# EAGLE design BasePCB (EAGLE 9.5.2)
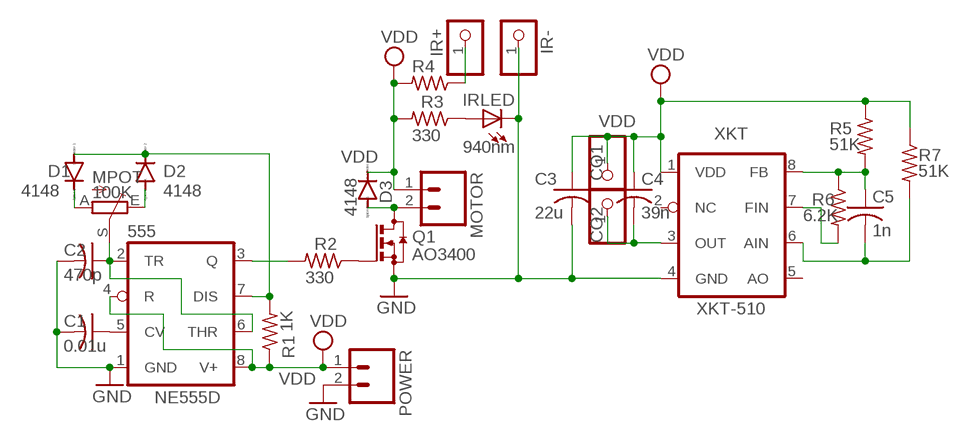
[diagram p0: schematic, sheet 1]

## Parts
555  NE555D  [SO08]
C1  0.01u  C-USC0603K  [C0603K]
C2  470p  C-USC0603K  [C0603K]
C3  22u  C-USC0805K  [C0805K]
C4  39n  C-USC0805K  [C0805K]
C5  1n  C-USC0805K  [C0805K]
CO1  PINHD-1X1CB  [1X01-CLEANBIG]
CO2  PINHD-1X1CB  [1X01-CLEANBIG]
D1  4148  DIODE-MINIMELF  [MINIMELF]
D2  4148  DIODE-MINIMELF  [MINIMELF]
D3  4148  DIODE-MINIMELF  [MINIMELF]
IR+  PINHD-1X1CB  [1X01-CLEANBIG]
IR-  PINHD-1X1CB  [1X01-CLEANBIG]
IRLED  940nm  LEDCHIPLED_0603  [CHIPLED_0603]
MOTOR  M021X02_NO_SILK  [1X02_NO_SILK]
MPOT  100K  TRIM_EU-CA6V  [CA6V]
POWER  M021X02_NO_SILK  [1X02_NO_SILK]
Q1  AO3400  BSS123  [SOT23]
R1  1K  R-US_R0603  [R0603]
R2  330  R-US_R0603  [R0603]
R3  330  R-US_R0603  [R0603]
R4  330  R-US_R0603  [R0603]
R5  51K  R-US_R0603  [R0603]
R6  6.2K  R-US_R0603  [R0603]
R7  51K  R-US_R0603  [R0603]
XKT  XKT-510  [SO08]

## Nets
GND: 555.1(GND) C1.2 C2.2 C3.2 IR-.1 IRLED.C POWER.2 Q1.2(S) XKT.4(GND)
N$1: 555.5(CV) C1.1
N$2: D1.C MPOT.A
N$3: 555.3(Q) R2.2
N$4: 555.2(TR) 555.6(THR) C2.1 MPOT.S
N$5: D2.A MPOT.E
N$6: 555.7(DIS) D1.A D2.C R1.2
N$7: Q1.1(G) R2.1
N$8: D3.A MOTOR.2 Q1.3(D)
N$9: IRLED.A R3.1
N$10: IR+.1 R4.1
N$11: C5.1 R5.2 R6.1 XKT.8(FB)
N$12: C4.2 CO2.1 XKT.3(OUT)
N$13: C5.2 R7.2 XKT.6(AIN)
N$14: R6.2 XKT.7(FIN)
VDD [VDD]: 555.4(R) 555.8(V+) C3.1 C4.1 CO1.1 D3.C MOTOR.1 POWER.1 R1.1 R3.2 R4.2 R5.1 R7.1 XKT.1(VDD)
Unconnected: XKT.2(NC) XKT.5(AO)

## Library data of the parts
555 = adafruit2013:*555: TIMER Changed DIP package to have round (not oval) pin pads http://www.ladyada.net/library/pcb/eaglelibrary.html
C1-C5 = adafruit2013:C-US: CAPACITOR, American symbol
CO1 CO2 IR+ IR- = adafruit2013:PINHD-1X1: Pin header 1x1 for 0.1" spacing With round pins
D1-D3 = diode:DIODE-: DIODE
IRLED = adafruit2013:LED: LED OSRAM: - CHIPLED LG R971, LG N971, LY N971, LG Q971, LY Q971, LO R971, LY R971 LH N974, LH R974 LS Q976, LO Q976, LY Q976 LO Q996 - Hyper CHIPLED LW Q18S LB Q993, LB Q99A, LB R99A - SideLED LS A670, LO A670, LY A670, LG A670, LP A670 LB A673, LV A673, LT A673, LW A673 LH A674 LY A675 LS A676, LA A676, LO A676, LY A676, LW A676 LS A679, LY A679, LG A679 - Hyper Micro SIDELED® LS Y876, LA Y876, LO Y876, LY Y876 LT Y87S - SmartLED LW L88C, LW L88S LB L89C, LB L89S, LG L890 LS L89K, LO L89K, LY L89K LS L896, LA L896, LO L896, LY L896 - TOPLED LS T670, LO T670, LY T670, LG T670, LP T670 LSG T670, LSP T670, LSY T670, LOP T670, LYG T670 LG T671, LOG T671, LSG T671 LB T673, LV T673, LT T673, LW T673 LH T674 LS T676, LA T676, LO T676, LY T676, LB T676, LH T676, LSB T676, LW T676 LB T67C, LV T67C, LT T67C, LS T67K, LO T67K, LY T67K, LW E67C LS E67B, LA E67B, LO E67B, LY E67B, LB E67C, LV E67C, LT E67C LW T67C LS T679, LY T679, LG T679 LS T770, LO T770, LY T770, LG T770, LP T770 LB T773, LV T773, LT T773, LW T773 LH T774 LS E675, LA E675, LY E675, LS T675 LS T776, LA T776, LO T776, LY T776, LB T776 LHGB T686 LT T68C, LB T68C - Hyper Mini TOPLED® LB M676 - Mini TOPLED Santana® LG M470 LS M47K, LO M47K, LY M47K Source: http://www.osram.convergy.de/
MOTOR POWER = SparkFunNew:M02: Header 2 Standard 2-pin 0.1" header. Use with straight break away headers (SKU : PRT-00116), right angle break away headers (PRT-00553), swiss pins (PRT-00743), machine pins (PRT-00117), and female headers (PRT-00115). Molex polarized connector foot print use with SKU : PRT-08233 with associated crimp pins and housings.
MPOT = pot:TRIM_EU-: POTENTIOMETER
Q1 = transistor-small-signal:BSS123: N-CHANNEL MOS FET
R1-R7 = adafruit2013:R-US_: RESISTOR, American symbol
XKT = adafruit2013:XKT-510

## Net classes
0 default: width 0.305 mm, clearance 0.254 mm
1 VDD: width 0.61 mm, clearance 0.305 mm

## Board
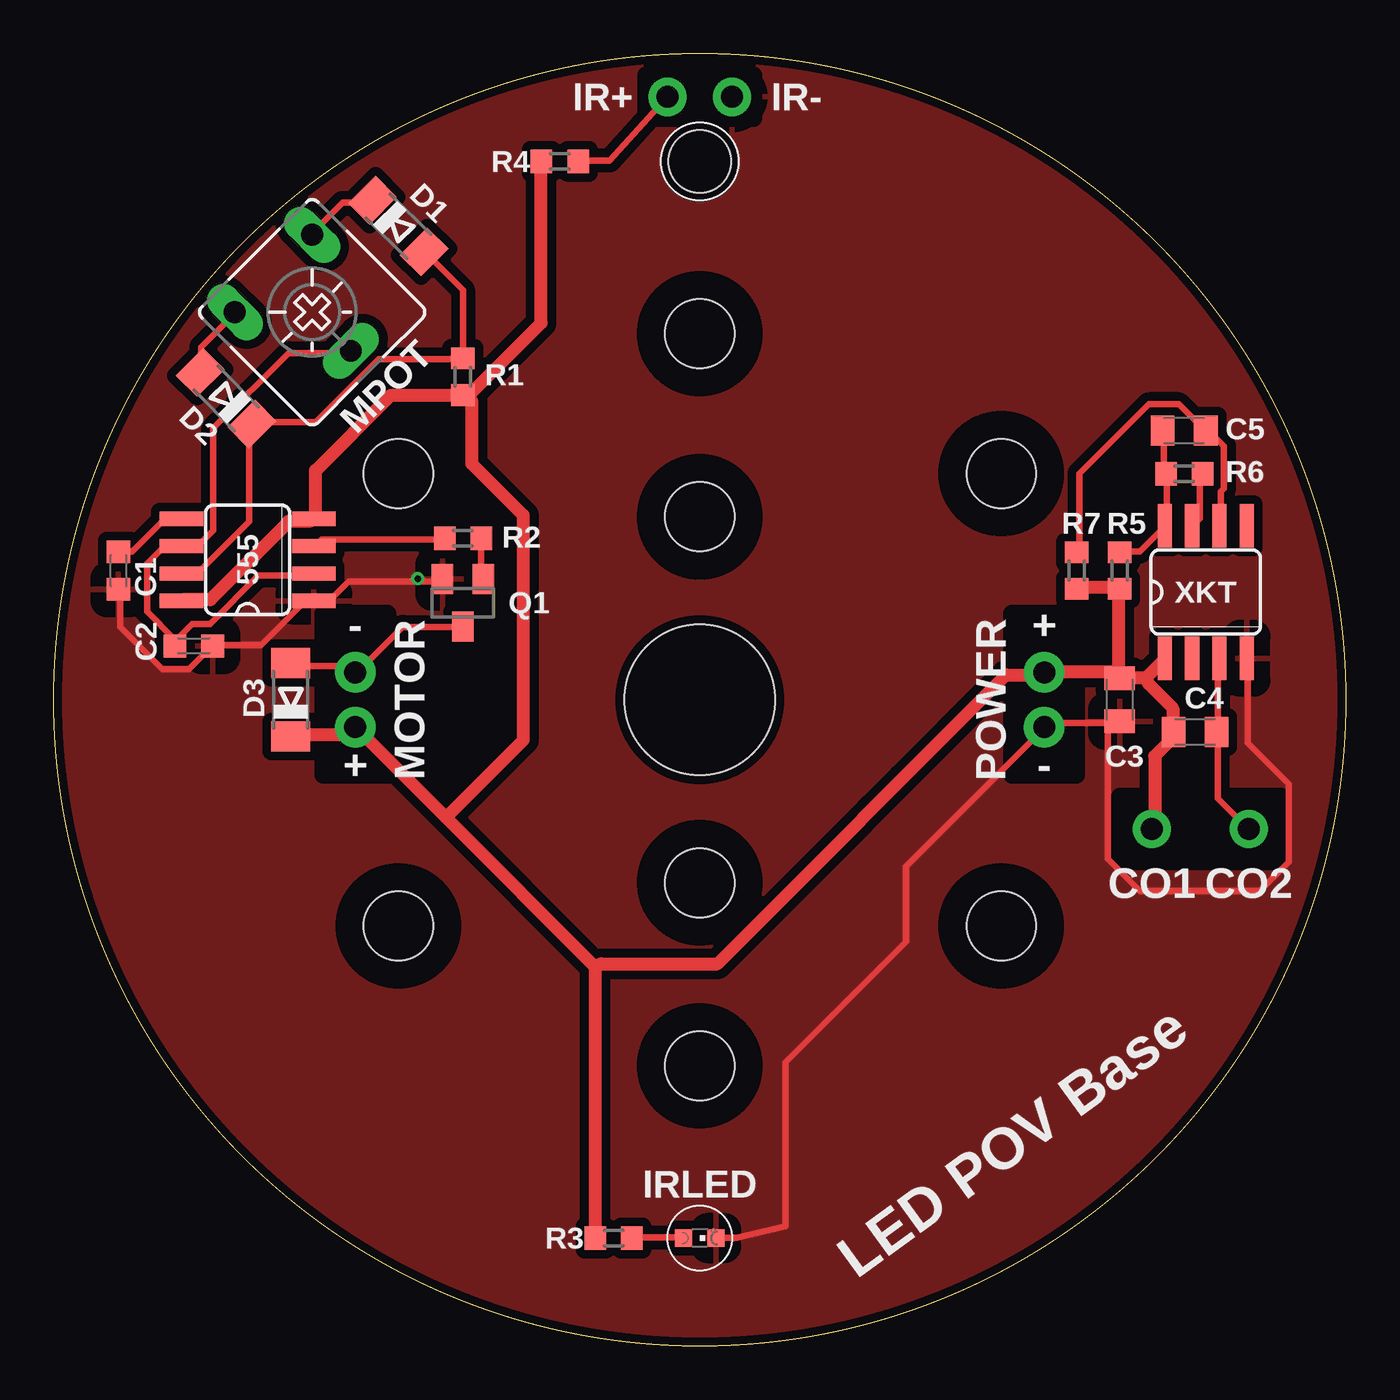
[diagram p1: board, top side]
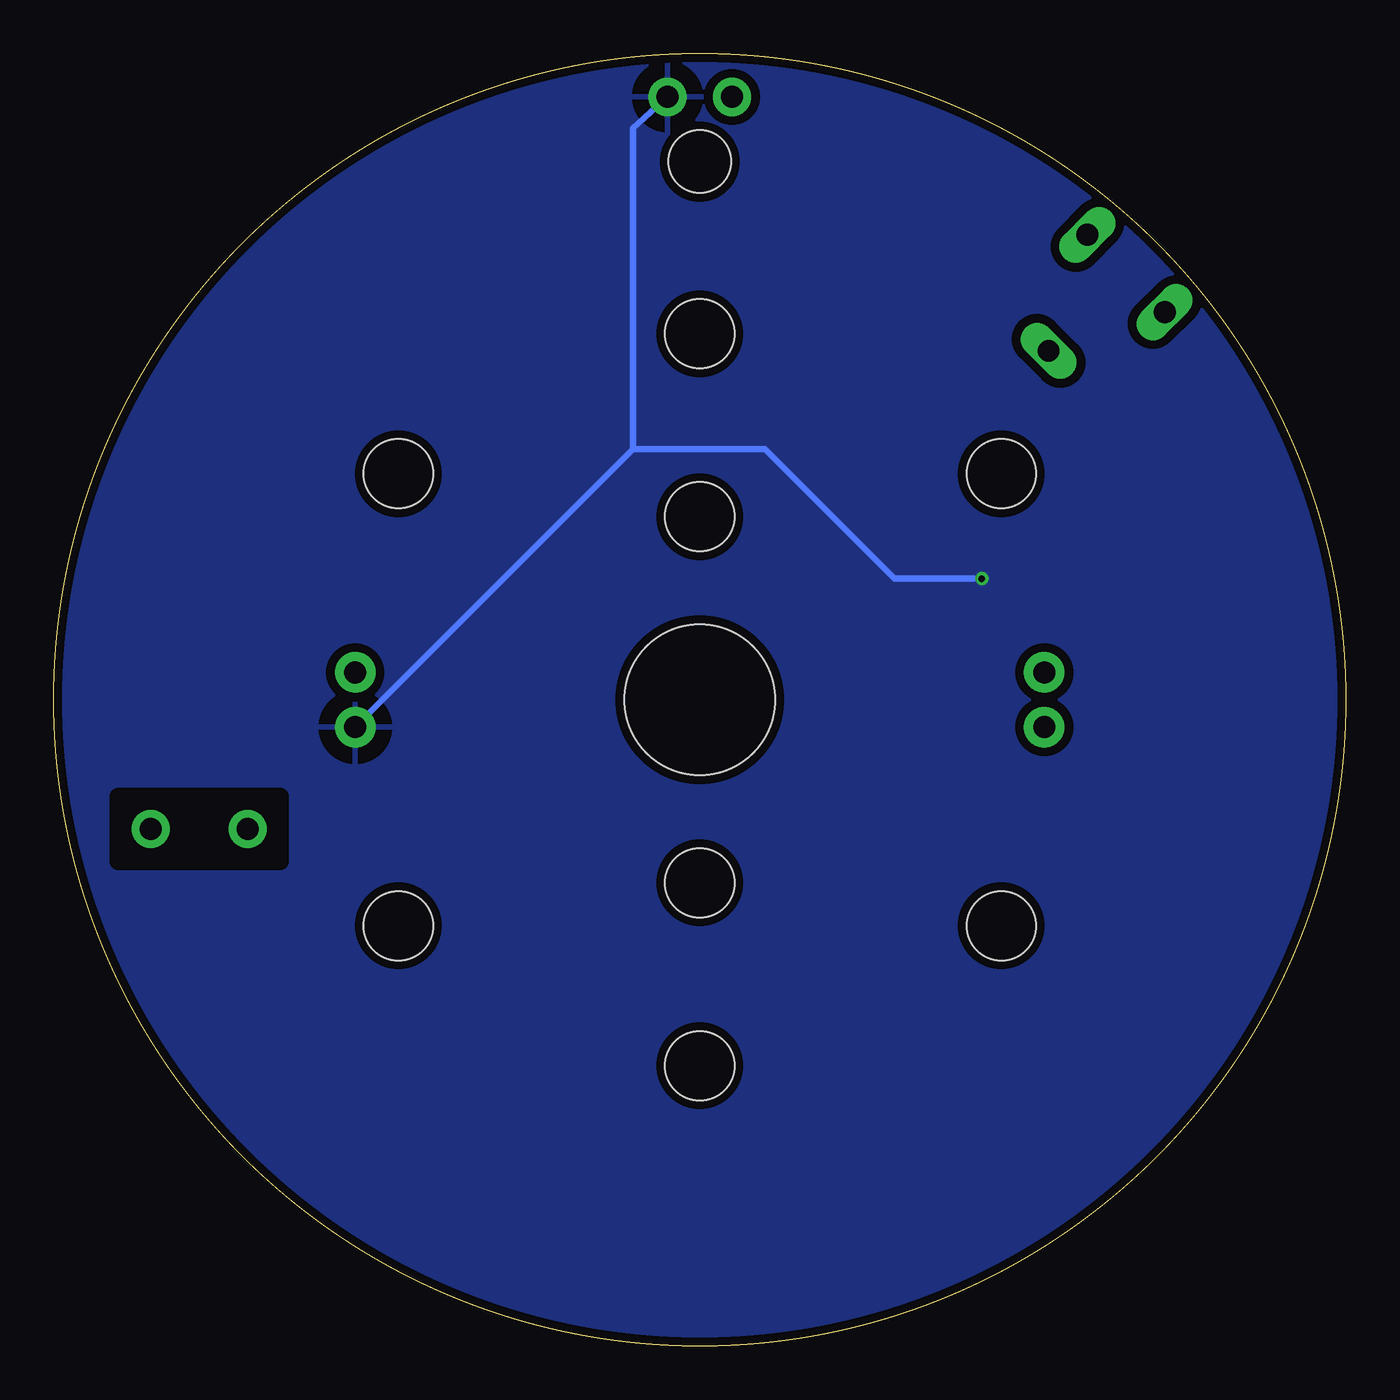
[diagram p2: board, bottom side, seen from below]

Size 60 x 60 mm. Coordinates in mm from the lower left corner, seen from the top.
Outline: circle at 30,30 radius 30
Copper layers (1*16): Top 0.035mm / dielectric 1.5mm / Bottom 0.035mm
Design rules "Fusion_eagle_rule_v1.1 *": minimum track width 6mil, minimum drill 12mil, track to track 6mil, track to pad 6mil, pad to pad 6mil, via to via 6mil, smd to smd 0mil, copper to edge 10mil, drill to drill 10mil, minimum pad ring 10mil, minimum via ring 6mil, stop-mask expansion 2mil, vias tented up to drill 100mil, thermal gap 30mil
Holes 7 mm at 30,30
Holes 3.2 mm at 30,21.5 30,38.5 30,13 30,47 44,19.5 44,40.5 16,19.5 16,40.5
Holes 2.9 mm at 30,55
tRestrict: area 27.5,44.5 to 32.5,49.5; area 41.5,38 to 46.5,43; area 27.5,36 to 32.5,41; area 27.5,19 to 32.5,24; area 13.5,38 to 18.5,43; area 13.5,17 to 18.5,22; area 27.5,10.5 to 32.5,15.5; area 41.5,17 to 46.5,22; area 49.5,22.5 to 57,25.5; area 12.5,26.5 to 15.5,34; area 44.5,26.5 to 47.5,34; area 27.5,57 to 29.5,59; area 30.5,57 to 32.5,59
bRestrict: area 49.5,22.5 to 57,25.5

### Footprints (pad centres in the part's own frame; a part is rotated, then mirrored left to right if it is on the bottom)
SO08 = smd 0.66 x 2.032: 1 -1.905,-3.073; 2 -0.635,-3.073; 3 0.635,-3.073; 4 1.905,-3.073; 5 1.905,3.073; 6 0.635,3.073; 7 -0.635,3.073; 8 -1.905,3.073
C0603K = smd 1.05 x 1.08: 1 -0.875,0; 2 0.875,0
C0805K = smd 1.1 x 1.4: 1 -1,0; 2 1,0
1X01-CLEANBIG = drill 1.016 pad 1.778: 1 0,0
MINIMELF = smd 1.4 x 1.8: A 1.7,0; C -1.7,0
CHIPLED_0603 = smd 0.8 x 0.8: A 0,-0.75; C 0,0.75
1X02_NO_SILK = drill 1.016 pad 1.88: 1 0,0; 2 2.54,0
CA6V = drill 1.016 long: A -2.54,-2.54; E 2.54,-2.54; S 0,2.54
SOT23 = smd 1 x 1.4: 1 -0.95,-1.1; 2 0.95,-1.1; 3 0,1.1
R0603 = smd 1 x 1.1: 1 -0.85,0; 2 0.85,0

### Placement (x,y rotation side)
555  9,36.5 90 top
C1  3,36 270 top
C2  6.5,32.5 0 top
C3  49.5,30 270 top
C4  53,28.5 0 top
C5  52.5,42.5 0 top
CO1  51,24 0 top
CO2  55.5,24 0 top
D1  16,52 315 top
D2  8,44 135 top
D3  11,30 90 top
IR+  28.5,58 0 top
IR-  31.5,58 0 top
IRLED  30,5 270 top
MOTOR  14,28.73 90 top
MPOT  12,48 225 top
POWER  46,31.27 270 top
Q1  19,34.5 180 top
R1  19,45 90 top
R2  19,37.5 180 top
R3  26,5 180 top
R4  23.5,55 180 top
R5  49.5,36 90 top
R6  52.5,40.5 0 top
R7  47.5,36 90 top
XKT  53.5,35 0 top

### Tracks (layer width: path | path; a pad name or v marks a point on that pad's centre or on a via)
GND  (via drill 0.3)
  Top 0.305: C1.2 3.07,35.06 3.07,33.39 5.03,31.43 6.29,31.43 7.26,32.41 C2.2 7.4,32.55 9.64,32.55 11.6,34.51 12.01,34.51 555.1 12.15,34.65 12.85,34.65 13.69,35.48 16.9,35.48 | 16.9,35.48 18.02,35.48 Q1.2 | IRLED.C 31.7,5 33.97,5.54 33.97,13.16 39.57,18.75 39.57,22.25 45.96,28.64 POWER.2 46.1,28.78 46.24,28.92 49.45,28.92 C3.2 49.22,28.72 48.95,28.78 48.95,22.61 50.43,21.13 56.02,21.13 57.36,22.47 57.36,26.09 55.46,27.98 55.46,31.85 XKT.4 | v16.9,35.62 16.9,35.48
  Bottom 0.305: 33.11,41.63 33.11,56.55 IR-.1 | 33.11,41.63 45.96,28.78 POWER.2 | v16.9,35.62 20.96,35.62 26.97,41.63 33.11,41.63
  pour Top (isolate 0.406): 0,60 60,60 60,0 0,0
  pour Bottom (isolate 0.406): 0,60 60,60 60,0 0,0
N$1
  Top 0.305: C1.1 3.07,36.88 3.63,36.88 5.03,38.28 5.87,38.28 555.5
N$2
  Top 0.305: D1.C 14.67,53.09 13.41,53.09 12.01,51.69 MPOT.A
N$3
  Top 0.305: R2.2 18.02,37.44 12.43,37.44 12.15,37.16 555.3
N$4
  Top 0.305: 555.2 12.01,35.76 9.5,35.76 7.26,33.53 6.43,33.53 5.73,32.83 C2.1 5.59,32.55 5.59,32.83 4.33,34.09 4.33,36.32 5.03,37.02 5.87,37.02 555.6 6.01,37.16 6.71,37.16 7.4,37.86 7.4,42.61 10.9,46.1 13.69,46.1 MPOT.S
N$5
  Top 0.305: D2.A 6.84,45.26 6.84,46.38 8.38,47.92 MPOT.E
N$6
  Top 0.305: D1.A 17.32,50.71 19,49.03 19,45.96 R1.2 18.86,45.82 15.09,45.82 12.15,42.89 9.22,42.89 D2.C 9.08,42.75 9.08,38.28 6.71,35.9 6.01,35.9 555.7
N$7
  Top 0.305: R2.1 19.84,37.44 19.84,35.62 Q1.1
N$8
  Top 0.305: Q1.3 19,33.39 16.2,33.39 14.11,31.29 MOTOR.2 13.97,31.29 13.69,31.57 11.04,31.57 D3.A
N$9
  Top 0.305: IRLED.A 29.2,5.03 26.96,5.03 R3.1
N$10
  Top 0.305: R4.1 24.45,55.04 25.82,55.04 IR+.1
N$11
  Top 0.305: C5.1 51.55,42.47 51.55,40.51 R6.1 51.69,40.37 51.69,38.14 XKT.8 51.55,38 50.43,36.88 49.59,36.88 R5.2
N$12
  Top 0.305: XKT.3 54.06,31.85 54.06,28.64 C4.2 54.06,28.5 54.06,25.43 55.46,24.03 CO2.1
N$13
  Top 0.305: R7.2 47.64,36.88 47.64,40.51 50.85,43.73 52.25,43.73 53.37,42.61 C5.2 53.65,42.47 54.34,41.77 54.34,39.81 54.2,39.67 54.2,38.14 XKT.6
N$14
  Top 0.305: R6.2 53.23,40.37 53.23,38.42 52.95,38.14 XKT.7
VDD
  Top 0.61: R1.1 15.65,44.15 12.15,40.65 12.15,38.42 555.4 11.87,38.28 10.9,38.28 7.26,34.65 6.01,34.65 555.8 | R4.2 22.63,54.9 22.63,47.5 19.28,44.15 R1.1 | R7.1 47.64,35.2 49.45,35.2 R5.1 49.45,34.92 49.45,31.29 C3.1 | 50.71,31.01 49.59,31.01 C3.1 | 50.71,31.01 51.55,31.85 XKT.1 | 50.71,31.01 50.85,30.73 51.97,29.62 51.97,28.64 C4.1 51.97,28.22 51.13,27.38 51.13,24.03 CO1.1 | C3.1 49.17,31.29 46.1,31.29 POWER.1 45.82,31.15 44.23,31.15 30.82,17.74 25.43,17.74 25.15,17.6 | 25.15,17.6 25.15,5.03 R3.2 | 18.21,24.54 14.11,28.64 MOTOR.1 13.97,28.36 11.04,28.36 D3.C | 18.21,24.54 25.15,17.6 | 18.21,24.54 21.81,28.14 21.81,38.56 19.42,40.95 19.42,43.87 R1.1

### Text on the board
tPlace: - | + | MOTOR | POWER | + | - | LED POV Base